# EAGLE design sensor_eeprom_v1.0 (EAGLE 9.6.2)
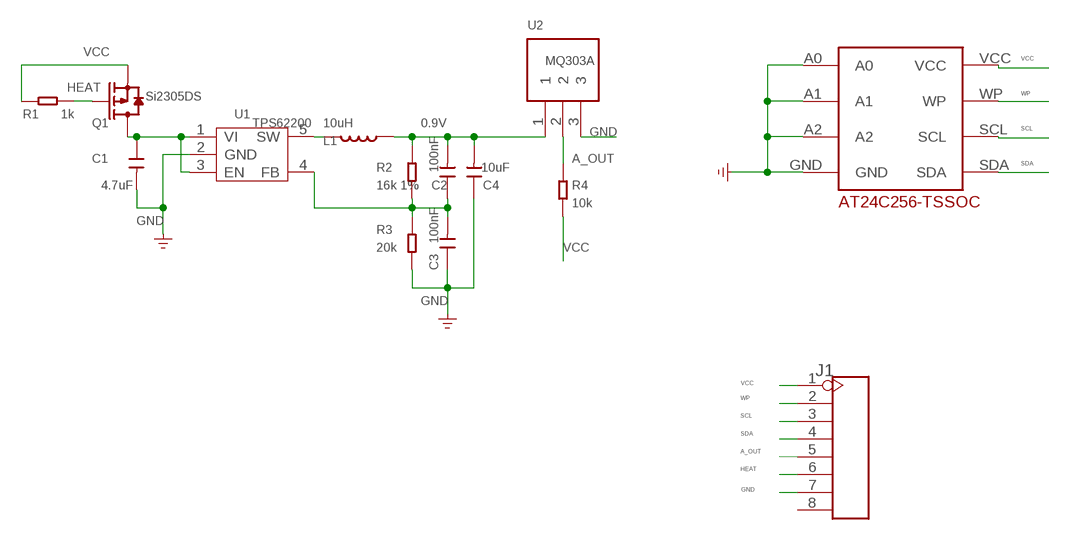
[diagram p0: schematic, sheet 1]

## Parts
C1  4.7uF  C-0805  [C0805]
C2  100nF  C-0603  [C0603]
C3  100nF  C-0603  [C0603]
C4  10uF  C-0805  [C0805]
J1  HEADER-8P-2.54  [8P-2.54]
L1  10uH  L'PIO73'  [PIO73]
Q1  Si2305DS  MOSFET-P'SI2323CDS/SI2305DS<BR>'  [SOT23]
R1  1k  R-0603  [R0603]
R2  16k 1%  R-0603  [R0603]
R3  20k  R-0603  [R0603]
R4  10k  R-0603  [R0603]
U1  TPS62200  TPS62200DBV  [SOT23-5]
U2  MQ303A  [MQ303A]
U$1  DECADE-AT24C256-10TI-2.7  [DECADE-AT24CXX]

## Nets
0.9V: C2.2 C4.2 L1.2 R2.1 U2.1
A_OUT: J1.5 R4.1 U2.2
GND: C1.2 C3.1 C4.1 J1.7 R3.2 U1.2(GND) U2.3 U$1.A0 U$1.A1 U$1.A2 U$1.GND
HEAT: J1.6 Q1.1(G) R1.1
N$1: C1.1 Q1.3(D) U1.1(VI) U1.3(EN)
N$2: L1.1 U1.5(SW)
N$3: C2.1 C3.2 R2.2 R3.1 U1.4(FB)
SCL: J1.3 U$1.SCL
SDA: J1.4 U$1.SDA
VCC: J1.1 Q1.2(S) R1.2 R4.2 U$1.VCC
WP: J1.2 U$1.WP
Unconnected: J1.8

## Library data of the parts
C1-C4 = Discrete:C*: Ceramic Capacitors
J1 = Connector:HEADER-8P
L1 = Discrete:L*
Q1 = Discrete:MOSFET-P
R1-R4 = Discrete:R*
U1 = IC:TPS62200: High-Efficiency,SOT23 STEP-DOWN,DC-DC Converter
U2 = MQ303A:MQ303A
U$1 = DECADE-libraries20151104:DECADE-AT24C256-10TI-2.7

## Board
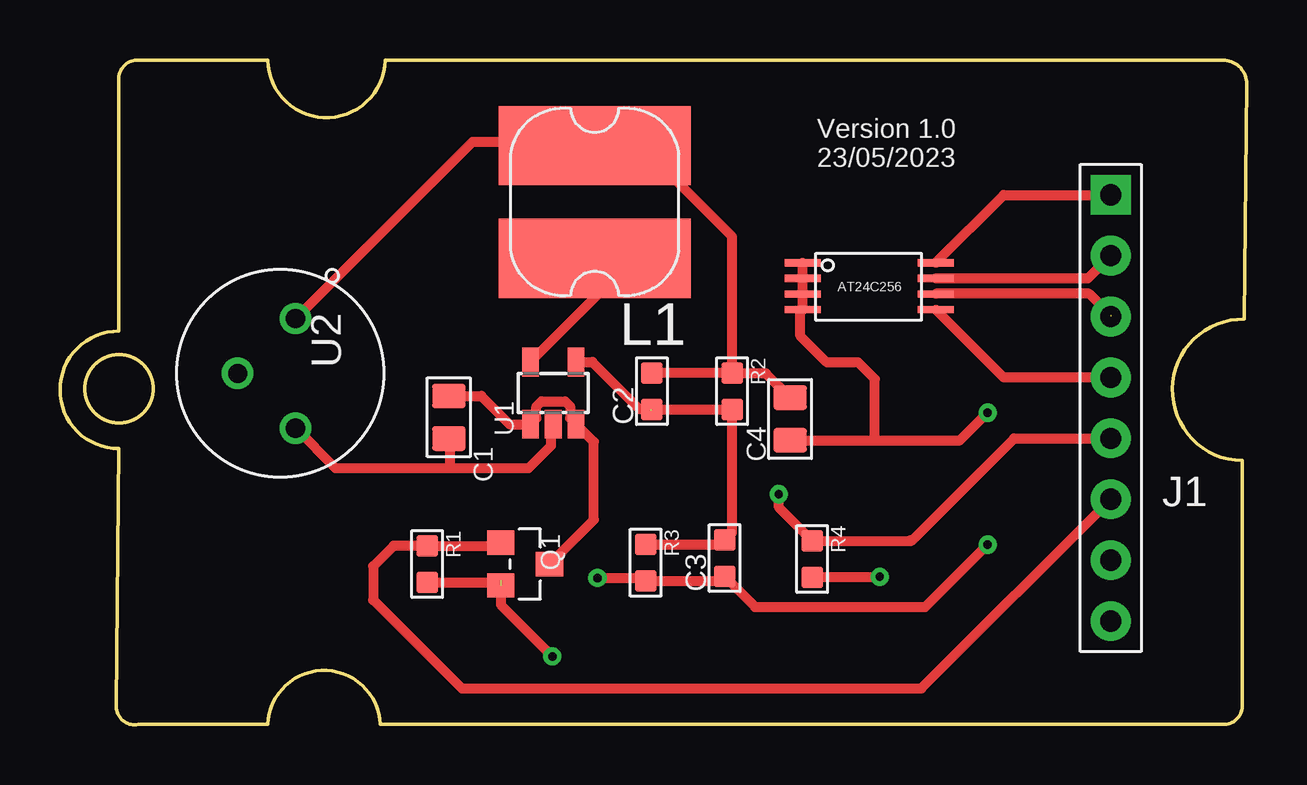
[diagram p1: board, top side]
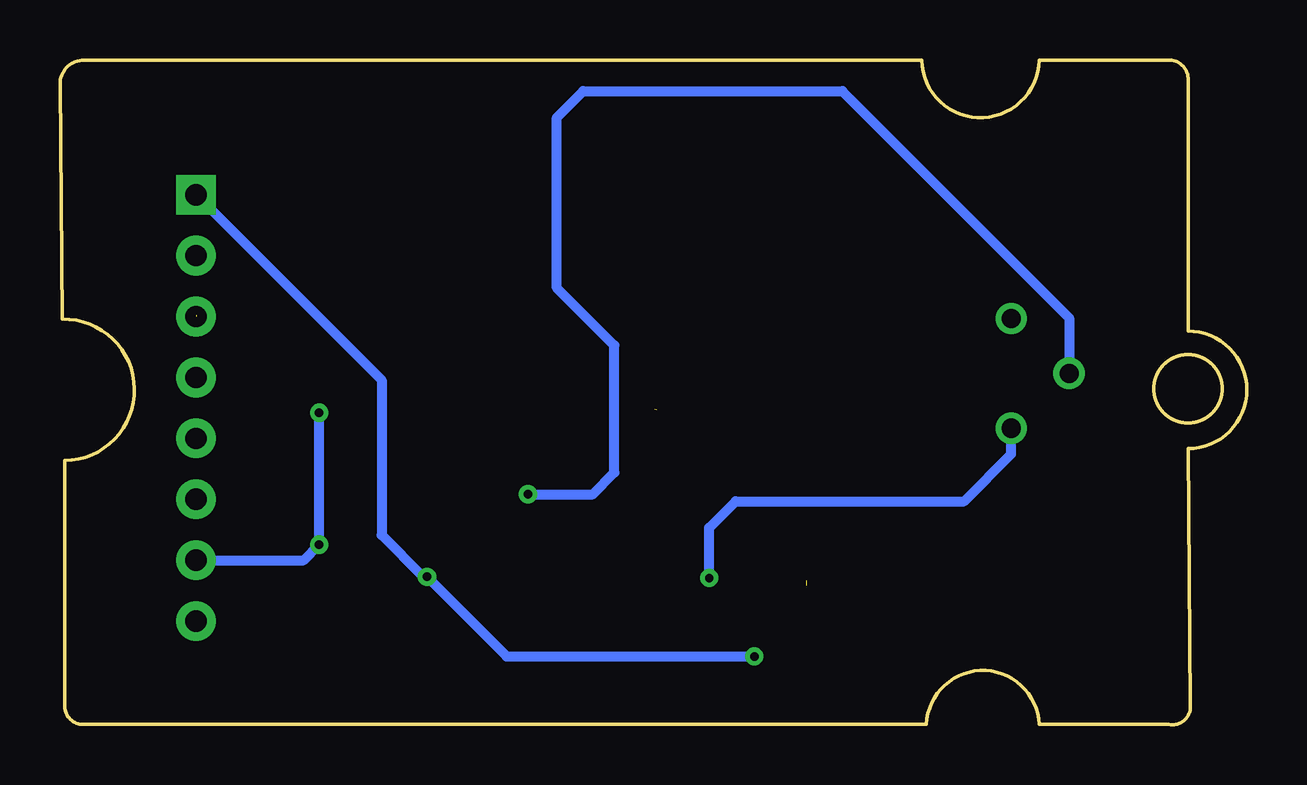
[diagram p2: board, bottom side, seen from below]

Size 49.45 x 27.72 mm. Coordinates in mm from the lower left corner, seen from the top.
Outline: 8.65,0.01 arc-175 13.35,0.01 48.55,0.01 arc94 49.25,0.91 49.25,11.01 arc-180 49.35,16.91 49.45,26.71 arc90 48.45,27.71 43.15,27.71 43.05,27.71 13.55,27.71 arc-178 8.65,27.71 3.35,27.71 arc104 2.45,26.81 2.45,16.41 arc180 2.45,11.51 2.35,0.81 arc105 3.25,0.01 8.65,0.01
Outline: circle at 2.45,14.01 radius 1.41
Copper layers (1*16): Top 0.035mm / dielectric 1.5mm / Bottom 0.035mm
Design rules "default": minimum track width 6mil, minimum drill 0.35mm, track to track 6mil, track to pad 6mil, pad to pad 6mil, via to via 6mil, smd to smd 6mil, copper to edge 40mil, drill to drill 6mil, minimum pad ring 10mil, minimum via ring 8mil, stop-mask expansion 4mil, vias tented up to drill 0mil, thermal gap 10mil

### Footprints (pad centres in the part's own frame; a part is rotated, then mirrored left to right if it is on the bottom)
C0805 = smd 1.016 x 1.397: 1 -0.889,0; 2 0.889,0
C0603 = smd 0.889 x 0.889: 1 -0.762,0; 2 0.762,0
8P-2.54 = drill 0.889 pad 1.651 square: 1 0,8.89 | drill 0.889 pad 1.651: 2 0,6.35; 3 0,3.81; 4 0,1.27; 5 0,-1.27; 6 0,-3.81; 7 0,-6.35; 8 0,-8.89
PIO73 = smd 8 x 3.3: 1 0,2.35; 2 0,-2.35
SOT23 = smd 1.016 x 1.143: 1 -0.889,-1.016; 2 0.889,-1.016; 3 0,1.016
R0603 = smd 0.889 x 0.889: 1 -0.762,0; 2 0.762,0
SOT23-5 = smd 0.69 x 1.2: 1 -0.95,-1.3; 2 0,-1.3; 3 0.95,-1.3; 4 0.95,1.3; 5 -0.95,1.3
MQ303A = drill 0.8: 1 -2.286,0.635; 2 0,-1.778; 3 2.286,0.635
DECADE-AT24CXX = smd 1.5 x 0.3: A0 -2.75,1; A1 -2.75,0.35; A2 -2.75,-0.3; GND -2.75,-0.95; SCL 2.8,-0.3; SDA 2.8,-0.95; VCC 2.8,1; WP 2.8,0.35

### Placement (x,y rotation side)
C1  16.2,12.82 270 top
C2  24.66,13.91 90 top
C3  27.69,6.95 90 top
C4  30.42,12.75 90 top
J1  43.78,13.21 0 top
L1  22.28,21.8 180 top
Q1  19.38,6.7 270 top
R1  15.3,6.7 270 top
R2  28,13.91 270 top
R3  24.4,6.76 270 top
R4  31.34,6.91 270 top
U1  20.55,13.83 0 top
U2  9.18,14.65 270 top
U$1  33.69,18.26 0 top

### Tracks (layer width: path | path; a pad name or v marks a point on that pad's centre or on a via)
0.9V
  Top 0.152: 24.61,14.57 C2.2 24.73,14.65 | 28.05,14.65 27.98,14.65 R2.1 28.07,14.75 | 22.44,24.41 L1.2
  Top 0.406: C2.2 R2.1 28,20.35 23.94,24.41 23.94,24.31 | 23.94,22.71 23.94,24.31 | L1.2 22.44,24.31 | 22.44,24.31 23.94,24.31 | C4.2 29.41,14.65 28.05,14.65 | U2.1 17.19,24.31 22.44,24.31
A_OUT  (via drill 0.35)
  Top 0.152: 39.75,11.94 39.68,11.94 35.44,7.7 | 31.34,7.64 R4.1
  Top 0.406: 35.42,7.67 R4.1 29.95,9.06 v29.95,9.61 | 35.44,7.7 35.42,7.67 | 35.42,7.67 35.48,7.67 39.75,11.94 J1.5
  Bottom 0.406: v29.95,9.61 27.25,9.61 26.35,10.51 26.35,15.81 28.75,18.21 28.75,25.32 27.65,26.42 16.85,26.42 7.4,16.97 U2.2
GND  (via drill 0.35)
  Top 0.152: 24.44,5.96 R3.2 | 27.58,6.08 27.68,6.18 | 27.68,6.18 C3.1 | 20.46,12.21 20.46,12.52 U1.2 | U$1.A0 30.45,19.26 | U2.3 9.78,12.41 | 16.25,11.88 C1.2 | 35.85,4.91 28.85,4.91 27.68,6.08 27.68,6.18
  Top 0.406: U2.3 11.48,10.71 16.25,10.71 | 16.25,10.71 16.25,11.88 | 20.46,12.21 20.46,11.64 19.52,10.71 16.25,10.71 | v22.4,6.12 24.28,6.12 R3.2 27.5,6 27.58,6.08 | C3.1 28.97,4.91 35.85,4.91 36.05,4.91 v38.65,7.51 | U$1.A0 U$1.A1 U$1.A2 U$1.GND 30.85,17.22 30.85,16.21 31.95,15.11 33.25,15.11 33.95,14.41 33.95,11.86 | C4.1 33.95,11.86 | 33.95,11.86 37.5,11.86 v38.65,13.01
  Bottom 0.152: 9.82,12.31 U2.3
  Bottom 0.406: v38.65,13.01 v38.65,7.51 39.3,6.86 J1.7 | v22.4,6.12 22.4,8.22 21.3,9.32 11.78,9.32 9.82,11.29 9.82,12.31
HEAT
  Top 0.152: Q1.1 18.23,7.45
  Top 0.406: Q1.1 18.24,7.46 R1.1 13.9,7.46 13.05,6.61 13.05,5.21 16.74,1.51 35.89,1.51 J1.6
N$1
  Top 0.152: 21.43,12.61 U1.3 | 19.54,12.52 U1.1
  Top 0.406: C1.1 17.55,13.71 18.73,12.53 U1.1 19.85,12.78 19.85,13.28 20.06,13.49 21.04,13.49 21.25,13.28 21.25,12.79 21.43,12.61 | Q1.3 22.24,8.55 22.24,11.8 22.23,11.8 U1.3
N$2
  Top 0.152: 23.3,18.86 23.64,19.2 L1.1
  Top 0.406: U1.5 23.3,18.83 23.3,18.86
N$3  (1 unrouted)
  Top 0.152: 27.47,7.49 C3.2 | 24.73,13.13 C2.1 | 27.98,13.13 R2.2 | 21.53,15.11 U1.4
  Top 0.406: R3.1 27.44,7.52 27.47,7.49 | C3.2 27.99,8.01 27.99,13.14 R2.2 27.98,13.13 24.59,13.13 | C2.1 24.16,13.15 22.18,15.13 U1.4
SCL  (1 unrouted)
  Top 0.152: 43.7,17.16 43.78,17.07
  Top 0.406: U$1.SCL 42.88,17.97 43.7,17.16
SDA
  Top 0.406: J1.4 39.32,14.48 U$1.SDA
VCC  (via drill 0.35)  (1 unrouted)
  Top 0.152: 36.64,19.33 U$1.VCC | 43.77,22.09 J1.1
  Top 0.406: 18.36,6.02 18.26,5.91 15.3,5.91 R1.2 | Q1.2 18.36,5 v20.52,2.85 | U$1.VCC 39.32,22.09 43.77,22.09 | R4.2 31.36,6.17 v34.16,6.17
  Bottom 0.152: 34.17,6.19 v34.16,6.17
  Bottom 0.406: J1.1 36.05,14.37 36.05,7.91 34.33,6.19 34.17,6.19 | v34.16,6.17 30.84,2.85 v20.52,2.85
WP
  Top 0.406: U$1.WP 42.83,18.61 J1.2

### Text on the board
tNames: Version 1.0 / 23/05/2023